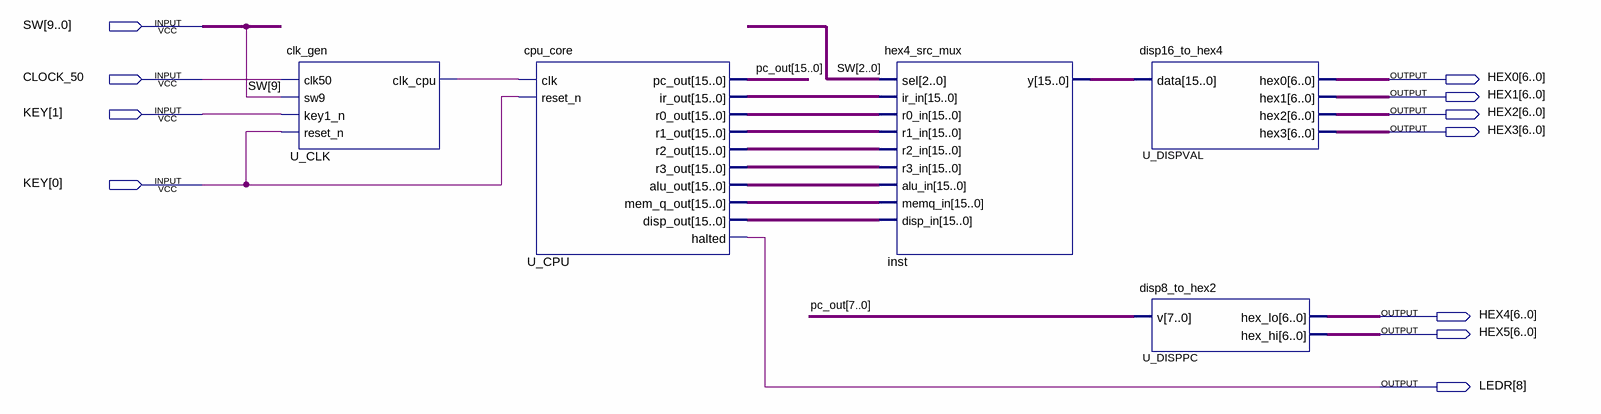
[diagram p0: schematic sheet]
// Quartus schematic cpu_top.bdf as structural Verilog: 5 symbols, 11 pins
module cpu_top (
  input  [9:0] SW,
  input  CLOCK_50,
  input  [1:0] KEY,
  output [6:0] HEX0,
  output [6:0] HEX1,
  output [6:0] HEX2,
  output [6:0] HEX3,
  output [6:0] HEX4,
  output [6:0] HEX5,
  output [8:8] LEDR
);

  wire U_CLK_clk_cpu;
  wire [15:0] inst_y, pc_out, U_CPU_alu_out, U_CPU_disp_out, U_CPU_ir_out, U_CPU_mem_q_out, U_CPU_r0_out,
       U_CPU_r1_out, U_CPU_r2_out, U_CPU_r3_out;

  clk_gen U_CLK (.clk50(CLOCK_50), .sw9(SW[9]), .key1_n(KEY[1]), .reset_n(KEY[0]), .clk_cpu(U_CLK_clk_cpu));
  cpu_core U_CPU (
    .clk(U_CLK_clk_cpu), .reset_n(KEY[0]), .pc_out(pc_out), .ir_out(U_CPU_ir_out), .r0_out(U_CPU_r0_out),
    .r1_out(U_CPU_r1_out), .r2_out(U_CPU_r2_out), .r3_out(U_CPU_r3_out), .alu_out(U_CPU_alu_out),
    .mem_q_out(U_CPU_mem_q_out), .disp_out(U_CPU_disp_out), .halted(LEDR[8]));
  hex4_src_mux inst (
    .sel(SW[2:0]), .ir_in(U_CPU_ir_out), .r0_in(U_CPU_r0_out), .r1_in(U_CPU_r1_out), .r2_in(U_CPU_r2_out),
    .r3_in(U_CPU_r3_out), .alu_in(U_CPU_alu_out), .memq_in(U_CPU_mem_q_out), .disp_in(U_CPU_disp_out),
    .y(inst_y));
  disp16_to_hex4 U_DISPVAL (.data(inst_y), .hex0(HEX0), .hex1(HEX1), .hex2(HEX2), .hex3(HEX3));
  disp8_to_hex2 U_DISPPC (.v(pc_out[7:0]), .hex_lo(HEX4), .hex_hi(HEX5));
endmodule
